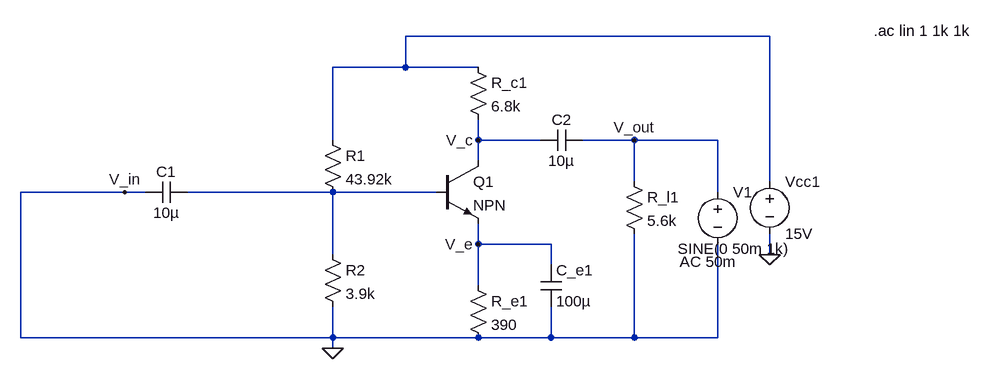
[diagram p0: schematic R_output_with_load.asc]
R_output_with_load.asc, the LTspice schematic file:
Version 4
SHEET 1 1112 680
WIRE 608 -80 48 -80
WIRE 48 -32 48 -80
WIRE 48 -32 -64 -32
WIRE 160 -32 48 -32
WIRE -64 80 -64 -32
WIRE 160 80 160 48
WIRE 256 80 160 80
WIRE 400 80 320 80
WIRE 528 80 400 80
WIRE 160 112 160 80
WIRE 400 144 400 80
WIRE 608 144 608 -80
WIRE -384 160 -544 160
WIRE -352 160 -384 160
WIRE -64 160 -288 160
WIRE 96 160 -64 160
WIRE 528 160 528 80
WIRE 160 240 160 208
WIRE 272 240 160 240
WIRE -64 256 -64 160
WIRE 608 256 608 224
WIRE 272 272 272 240
WIRE 160 304 160 240
WIRE -544 384 -544 160
WIRE -64 384 -64 336
WIRE -64 384 -544 384
WIRE 160 384 -64 384
WIRE 272 384 272 336
WIRE 272 384 160 384
WIRE 400 384 400 224
WIRE 400 384 272 384
WIRE 528 384 528 240
WIRE 528 384 400 384
WIRE -64 400 -64 384
FLAG -64 400 0
FLAG 608 256 0
FLAG 160 80 V_c
FLAG 160 240 V_e
FLAG -384 160 V_in
FLAG 400 80 V_out
SYMBOL npn 96 112 R0
SYMATTR InstName Q1
SYMBOL res 144 -48 R0
SYMATTR InstName R_c1
SYMATTR Value 6.8k
SYMBOL res -80 64 R0
SYMATTR InstName R1
SYMATTR Value 43.92k
SYMBOL res -80 240 R0
SYMATTR InstName R2
SYMATTR Value 3.9k
SYMBOL res 144 288 R0
SYMATTR InstName R_e1
SYMATTR Value 390
SYMBOL res 384 128 R0
SYMATTR InstName R_l1
SYMATTR Value 5.6k
SYMBOL cap -288 144 R90
WINDOW 0 0 32 VBottom 2
WINDOW 3 32 32 VTop 2
SYMATTR InstName C1
SYMATTR Value 10µ
SYMBOL cap 256 96 R270
WINDOW 0 32 32 VTop 2
WINDOW 3 0 32 VBottom 2
SYMATTR InstName C2
SYMATTR Value 10µ
SYMBOL voltage 608 128 R0
WINDOW 123 0 0 Left 0
WINDOW 39 0 0 Left 0
SYMATTR InstName Vcc1
SYMATTR Value 15V
SYMBOL cap 256 272 R0
SYMATTR InstName C_e1
SYMATTR Value 100µ
SYMBOL voltage 528 144 R0
WINDOW 3 -61 103 Left 2
WINDOW 123 -58 123 Left 2
WINDOW 39 0 0 Left 0
SYMATTR InstName V1
SYMATTR Value SINE(0 50m 1k)
SYMATTR Value2 AC 50m
TEXT 768 -88 Left 2 !.ac lin 1 1k 1k

The netlist it stands for:
* R_output_with_load.asc
Q1 V_c N002 V_e 0 NPN
R_c1 N001 V_c 6.8k
R1 N001 N002 43.92k
R2 N002 0 3.9k
R_e1 V_e 0 390
R_l1 V_out 0 5.6k
C1 N002 0 10µ
C2 V_c V_out 10µ
Vcc1 N001 0 15V
C_e1 V_e 0 100µ
V1 V_out 0 SINE(0 50m 1k) AC 50m
.model NPN NPN
.model PNP PNP
.lib standard.bjt
.ac lin 1 1k 1k
.backanno
.end